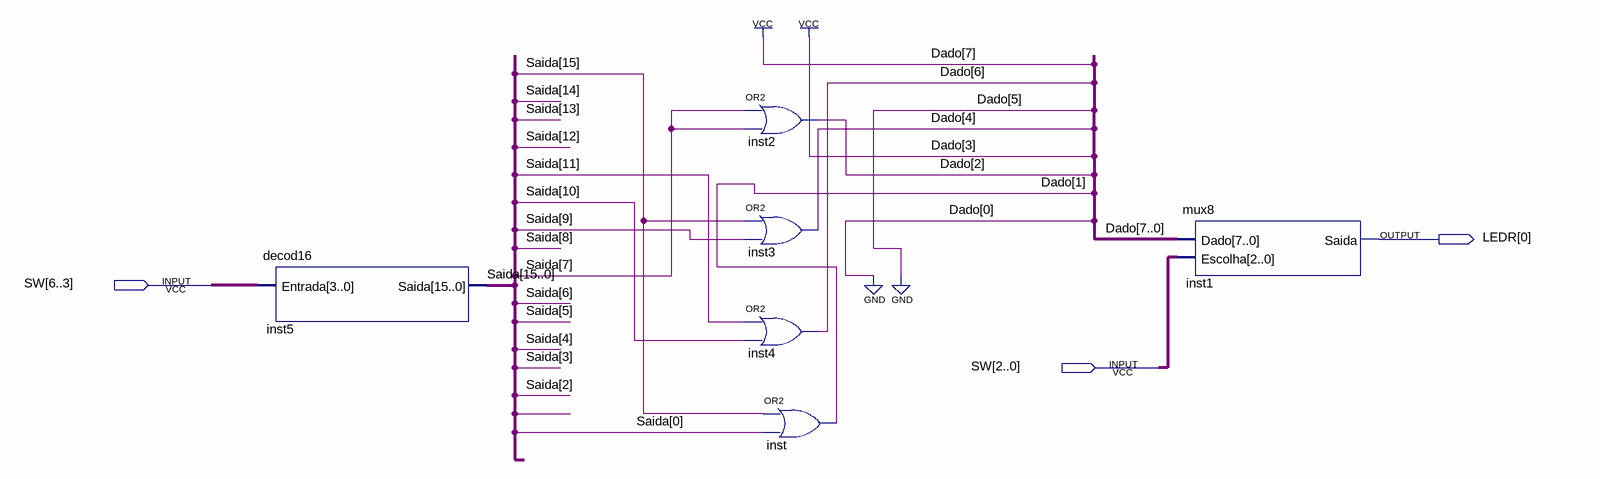
[diagram p0: schematic sheet]
// Quartus schematic Block3.bdf as structural Verilog: 6 symbols, 3 pins
module Block3 (
  input  [6:0] SW,
  output [0:0] LEDR
);

  wire [6:1] Dado;
  wire [15:0] Saida;

  decod16 inst5 (.Entrada(SW[6:3]), .Saida(Saida));
  or inst2 (Dado[2], Saida[7], Saida[7]);
  or inst3 (Dado[4], Saida[15], Saida[9]);
  or inst4 (Dado[6], Saida[11], Saida[10]);
  or inst (Dado[1], Saida[15], Saida[0]);
  mux8 inst1 (.Dado({1'b1, Dado[6], 1'b0, Dado[4], 1'b1, Dado[2:1], 1'b0}), .Escolha(SW[2:0]), .Saida(LEDR[0]));
endmodule
